# EAGLE design arduipi_test_board (EAGLE 6.4)
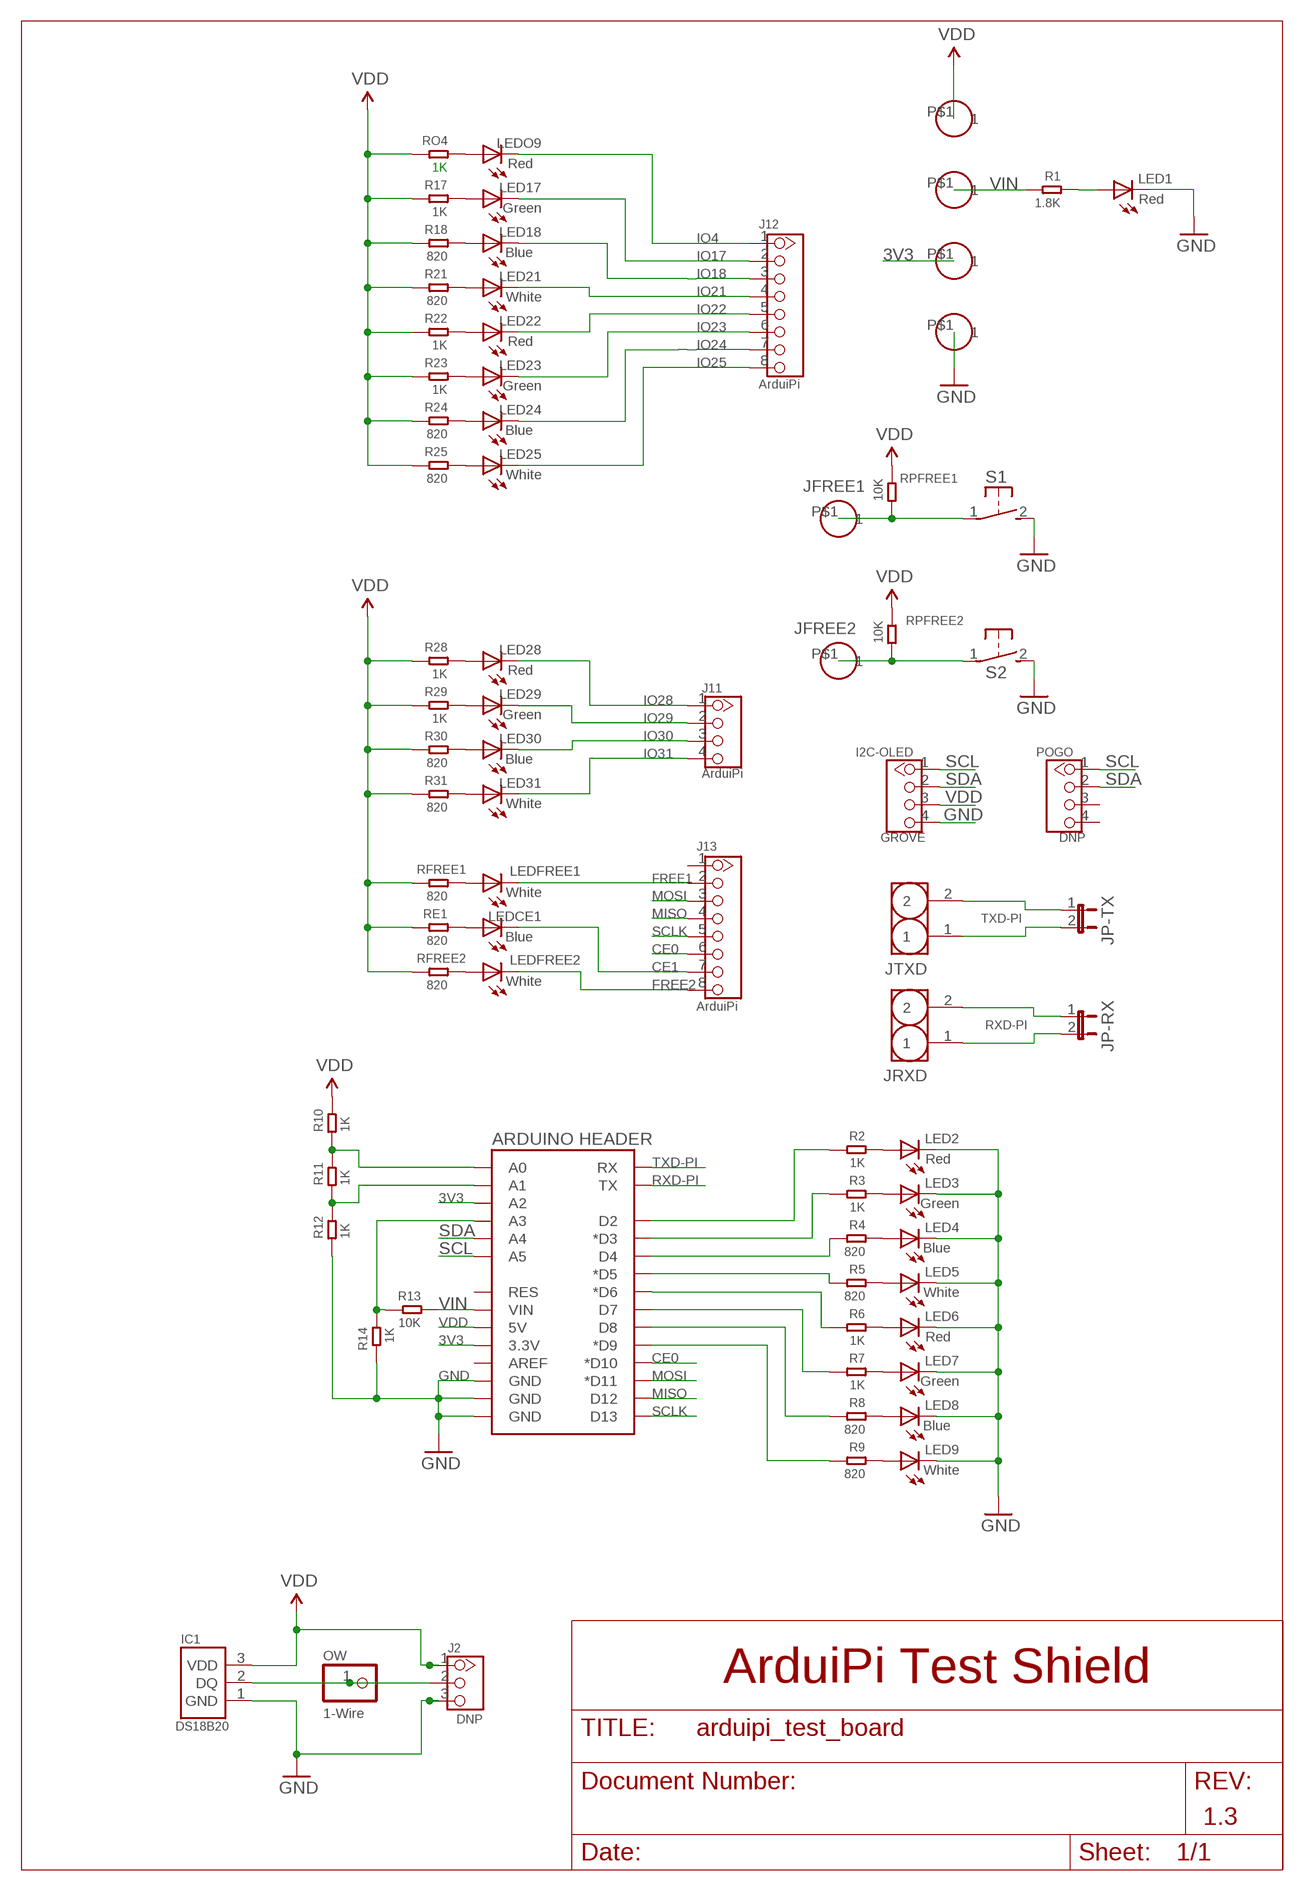
[diagram p0: schematic, sheet 1]

## Parts
3V3  HEADER-1P-32  [1P-60/32MIL]
GND  HEADER-1P-32  [1P-60/32MIL]
I2C-OLED  GROVE  TWIG-2.0-LEADED  [4P-LEADED-2.0]
IC1  DS18B20  SENSOR-DS18B20  [TO-92-TRIANGLE]
J2  DNP  HEADER-3P-2.54  [3P-2.54]
J11  ArduiPi  HEADER-4P-80/40MIL  [4P-2.54-80/40MIL]
J12  ArduiPi  HEADER-8P-80/40MIL  [8P-2.54-80/40MIL]
J13  ArduiPi  HEADER-8P-80/40MIL  [8P-2.54-80/40MIL]
JFREE1  HEADER-1P-32  [1P-60/32MIL]
JFREE2  HEADER-1P-32  [1P-60/32MIL]
JP-RX  JUMPER-2PTH  [1X02]
JP-TX  JUMPER-2PTH  [1X02]
JRXD  J2  HEADER-2P-2.54  [2P-2.54]
JTXD  J1  HEADER-2P-2.54  [2P-2.54]
LED1  Red  LED3MM  [LED3MM]
LED2  Red  LED3MM  [LED3MM]
LED3  Green  LED3MM  [LED3MM]
LED4  Blue  LED3MM  [LED3MM]
LED5  White  LED3MM  [LED3MM]
LED6  Red  LED3MM  [LED3MM]
LED7  Green  LED3MM  [LED3MM]
LED8  Blue  LED3MM  [LED3MM]
LED9  White  LED3MM  [LED3MM]
LED17  Green  LED3MM  [LED3MM]
LED18  Blue  LED3MM  [LED3MM]
LED21  White  LED3MM  [LED3MM]
LED22  Red  LED3MM  [LED3MM]
LED23  Green  LED3MM  [LED3MM]
LED24  Blue  LED3MM  [LED3MM]
LED25  White  LED3MM  [LED3MM]
LED28  Red  LED3MM  [LED3MM]
LED29  Green  LED3MM  [LED3MM]
LED30  Blue  LED3MM  [LED3MM]
LED31  White  LED3MM  [LED3MM]
LEDCE1  Blue  LED3MM  [LED3MM]
LEDFREE1  White  LED3MM  [LED3MM]
LEDFREE2  White  LED3MM  [LED3MM]
LEDO9  Red  LED3MM  [LED3MM]
OW  1-Wire  PINHD-1X1  [1X01]
POGO  DNP  TWIG-2.0-LEADED  [4P-LEADED-2.0]
R1  1.8K  R-0204/7  [0204/7]
R2  1K  R-0204/7  [0204/7]
R3  1K  R-0204/7  [0204/7]
R4  820  R-0204/7  [0204/7]
R5  820  R-0204/7  [0204/7]
R6  1K  R-0204/7  [0204/7]
R7  1K  R-0204/7  [0204/7]
R8  820  R-0204/7  [0204/7]
R9  820  R-0204/7  [0204/7]
R10  1K  R-0204/7  [0204/7]
R11  1K  R-0204/7  [0204/7]
R12  1K  R-0204/7  [0204/7]
R13  10K  R-0204/7  [0204/7]
R14  1K  R-0204/7  [0204/7]
R17  1K  R-0204/7  [0204/7]
R18  820  R-0204/7  [0204/7]
R21  820  R-0204/7  [0204/7]
R22  1K  R-0204/7  [0204/7]
R23  1K  R-0204/7  [0204/7]
R24  820  R-0204/7  [0204/7]
R25  820  R-0204/7  [0204/7]
R28  1K  R-0204/7  [0204/7]
R29  1K  R-0204/7  [0204/7]
R30  820  R-0204/7  [0204/7]
R31  820  R-0204/7  [0204/7]
RE1  820  R-0204/7  [0204/7]
RFREE1  820  R-0204/7  [0204/7]
RFREE2  820  R-0204/7  [0204/7]
RO4  1K  R-0204/7  [0204/7]
RPFREE1  10K  R-0204/7  [0204/7]
RPFREE2  10K  R-0204/7  [0204/7]
S1  DTS-3  [DTS-3]
S2  DTS-3  [DTS-3]
U1  ARDUINO HEADER  ARDUINO_SHIELDNO_SILK  [DUEMILANOVE_VIAS]
VDD  HEADER-1P-32  [1P-60/32MIL]
VIN  HEADER-1P-32  [1P-60/32MIL]

## Nets
3V3: 3V3.P$1 U1.3.3V U1.A2
CE0: J13.6 U1.D10(*D10)
CE1: J13.7 LEDCE1.K(C)
DQ: IC1.2(DQ) J2.2 OW.1
FREE1: J13.2 LEDFREE1.K(C)
FREE1-PI: JFREE1.P$1 RPFREE1.2 S1.1
FREE2: J13.8 LEDFREE2.K(C)
FREE2-PI: JFREE2.P$1 RPFREE2.1 S2.1
GND: GND.P$1 I2C-OLED.4 IC1.1(GND) J2.3 LED1.K(C) LED2.K(C) LED3.K(C) LED4.K(C) LED5.K(C) LED6.K(C) LED7.K(C) LED8.K(C) LED9.K(C) R12.1 R14.2 S1.2 S2.2 U1.GND@0(GND) U1.GND@1(GND) U1.GND@2(GND)
IO4: J12.1 LEDO9.K(C)
IO17: J12.2 LED17.K(C)
IO18: J12.3 LED18.K(C)
IO21: J12.4 LED21.K(C)
IO22: J12.5 LED22.K(C)
IO23: J12.6 LED23.K(C)
IO24: J12.7 LED24.K(C)
IO25: J12.8 LED25.K(C)
IO28: J11.1 LED28.K(C)
IO29: J11.2 LED29.K(C)
IO30: J11.3 LED30.K(C)
IO31: J11.4 LED31.K(C)
MISO: J13.4 U1.D12
MOSI: J13.3 U1.D11(*D11)
N$1: R11.1 R12.2 U1.A1
N$2: R10.1 R11.2 U1.A0
N$3: LED1.A R1.1
N$4: R13.2 R14.1 U1.A3
N$5: LED2.A R2.1
N$6: JP-TX.2 JTXD.1
N$7: LED3.A R3.1
N$8: LED4.A R4.1
N$9: LED5.A R5.1
N$10: JP-RX.2 JRXD.1
N$11: LED6.A R6.1
N$12: LED7.A R7.1
N$13: LED8.A R8.1
N$14: LED9.A R9.1
N$16: LEDO9.A RO4.1
N$17: LED17.A R17.1
N$18: LED18.A R18.1
N$19: LED21.A R21.1
N$20: LED22.A R22.1
N$21: LED23.A R23.1
N$22: LED24.A R24.1
N$23: R9.2 U1.D9(*D9)
N$24: R8.2 U1.D8
N$25: R7.2 U1.D7
N$26: R6.2 U1.D6(*D6)
N$27: R5.2 U1.D5(*D5)
N$28: R4.2 U1.D4
N$29: R3.2 U1.D3(*D3)
N$30: R2.2 U1.D2
N$31: LED25.A R25.1
N$33: LEDFREE1.A RFREE1.1
N$51: LED28.A R28.1
N$52: LED29.A R29.1
N$53: LED30.A R30.1
N$54: LED31.A R31.1
N$57: LEDCE1.A RE1.1
N$58: LEDFREE2.A RFREE2.1
RXD-PI: JP-RX.1 JRXD.2 U1.TX
SCL: I2C-OLED.1 POGO.1 U1.A5
SCLK: J13.5 U1.D13
SDA: I2C-OLED.2 POGO.2 U1.A4
TXD-PI: JP-TX.1 JTXD.2 U1.RX
VDD: I2C-OLED.3 IC1.3(VDD) J2.1 R10.2 R17.2 R18.2 R21.2 R22.2 R23.2 R24.2 R25.2 R28.2 R29.2 R30.2 R31.2 RE1.2 RFREE1.2 RFREE2.2 RO4.2 RPFREE1.1 RPFREE2.2 U1.5V VDD.P$1
VIN: R1.2 R13.1 U1.VIN VIN.P$1
Unconnected: J13.1 POGO.3 POGO.4 U1.AREF U1.RES

## Notes on the sheet
- ArduiPi Test Shield
- 1.3

## Library data of the parts
3V3 GND JFREE1 JFREE2 VDD VIN = Seeedstudio-Connector:HEADER-1P
I2C-OLED POGO = Connector:TWIG-2.0-LEADED
IC1 = Seeedstudio-Discrete.rpt:SENSOR-DS18B20: DS18B20: Programmable Resolution 1-Wire Digital Thermometer http://datasheets.maxim-ic.com/en/ds/DS18B20.pdf
J2 = Seeedstudio-Connector:HEADER-3P
J11 = Seeedstudio-Connector:HEADER-4P
J12 J13 = Seeedstudio-Connector:HEADER-8P
JP-RX JP-TX = SparkFun-Passives:JUMPER-2: Jumper Basic 0.1" spaced jumper. Use with breakaway headers.
JRXD JTXD = Seeedstudio-Connector:HEADER-2P
LED1-LED9 LED17 LED18 LED21-LED25 LED28-LED31 LEDCE1 LEDFREE1 LEDFREE2 LEDO9 = led:LED: LED OSRAM: - CHIPLED LG R971, LG N971, LY N971, LG Q971, LY Q971, LO R971, LY R971 LH N974, LH R974 LS Q976, LO Q976, LY Q976 LO Q996 - Hyper CHIPLED LW Q18S LB Q993, LB Q99A, LB R99A - SideLED LS A670, LO A670, LY A670, LG A670, LP A670 LB A673, LV A673, LT A673, LW A673 LH A674 LY A675 LS A676, LA A676, LO A676, LY A676, LW A676 LS A679, LY A679, LG A679 - Hyper Micro SIDELED® LS Y876, LA Y876, LO Y876, LY Y876 LT Y87S - SmartLED LW L88C, LW L88S LB L89C, LB L89S, LG L890 LS L89K, LO L89K, LY L89K LS L896, LA L896, LO L896, LY L896 - TOPLED LS T670, LO T670, LY T670, LG T670, LP T670 LSG T670, LSP T670, LSY T670, LOP T670, LYG T670 LG T671, LOG T671, LSG T671 LB T673, LV T673, LT T673, LW T673 LH T674 LS T676, LA T676, LO T676, LY T676, LB T676, LH T676, LSB T676, LW T676 LB T67C, LV T67C, LT T67C, LS T67K, LO T67K, LY T67K, LW E67C LS E67B, LA E67B, LO E67B, LY E67B, LB E67C, LV E67C, LT E67C LW T67C LS T679, LY T679, LG T679 LS T770, LO T770, LY T770, LG T770, LP T770 LB T773, LV T773, LT T773, LW T773 LH T774 LS E675, LA E675, LY E675, LS T675 LS T776, LA T776, LO T776, LY T776, LB T776 LHGB T686 LT T68C, LB T68C - Hyper Mini TOPLED® LB M676 - Mini TOPLED Santana® LG M470 LS M47K, LO M47K, LY M47K Source: http://www.osram.convergy.de LUXEON: - LUMILED® LXK2-PW12-R00, LXK2-PW12-S00, LXK2-PW14-U00, LXK2-PW14-V00 LXK2-PM12-R00, LXK2-PM12-S00, LXK2-PM14-U00 LXK2-PE12-Q00, LXK2-PE12-R00, LXK2-PE12-S00, LXK2-PE14-T00, LXK2-PE14-U00 LXK2-PB12-K00, LXK2-PB12-L00, LXK2-PB12-M00, LXK2-PB14-N00, LXK2-PB14-P00, LXK2-PB14-Q00 LXK2-PR12-L00, LXK2-PR12-M00, LXK2-PR14-Q00, LXK2-PR14-R00 LXK2-PD12-Q00, LXK2-PD12-R00, LXK2-PD12-S00 LXK2-PH12-R00, LXK2-PH12-S00 LXK2-PL12-P00, LXK2-PL12-Q00, LXK2-PL12-R00 Source: www.luxeon.com KINGBRIGHT: KA-3528ASYC Source: www.kingbright.com
OW = adafruit:PINHD-1X1: Pin header 1x1 for 0.1" spacing With round pins
R1-R14 R17 R18 R21-R25 R28-R31 RE1 RFREE1 RFREE2 RO4 RPFREE1 RPFREE2 = Seeedstudio-Discrete.rpt:R*
S1 S2 = switch-tact:DTS-3
U1 = SparkFun-Boards:ARDUINO_SHIELD: Arduino shield footprint

## Net classes
0 default: width 0.203 mm, drill 0.305 mm, clearance 0.152 mm
1 GND: width 0.305 mm, drill 0.305 mm, clearance 0.152 mm
2 VDD: width 0.305 mm, drill 0.305 mm, clearance 0.152 mm

## Board
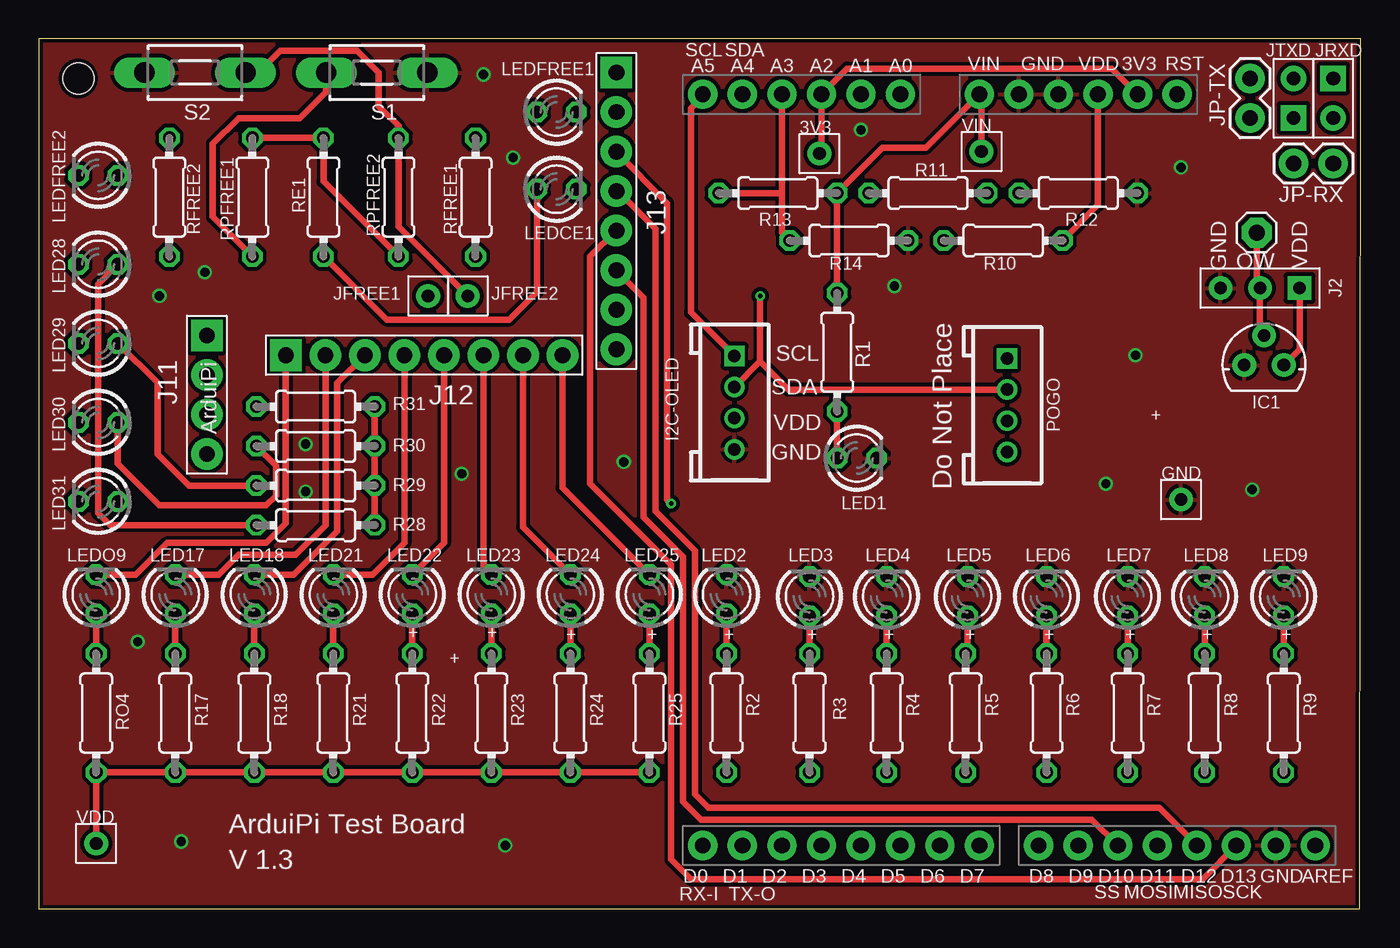
[diagram p1: board, top side]
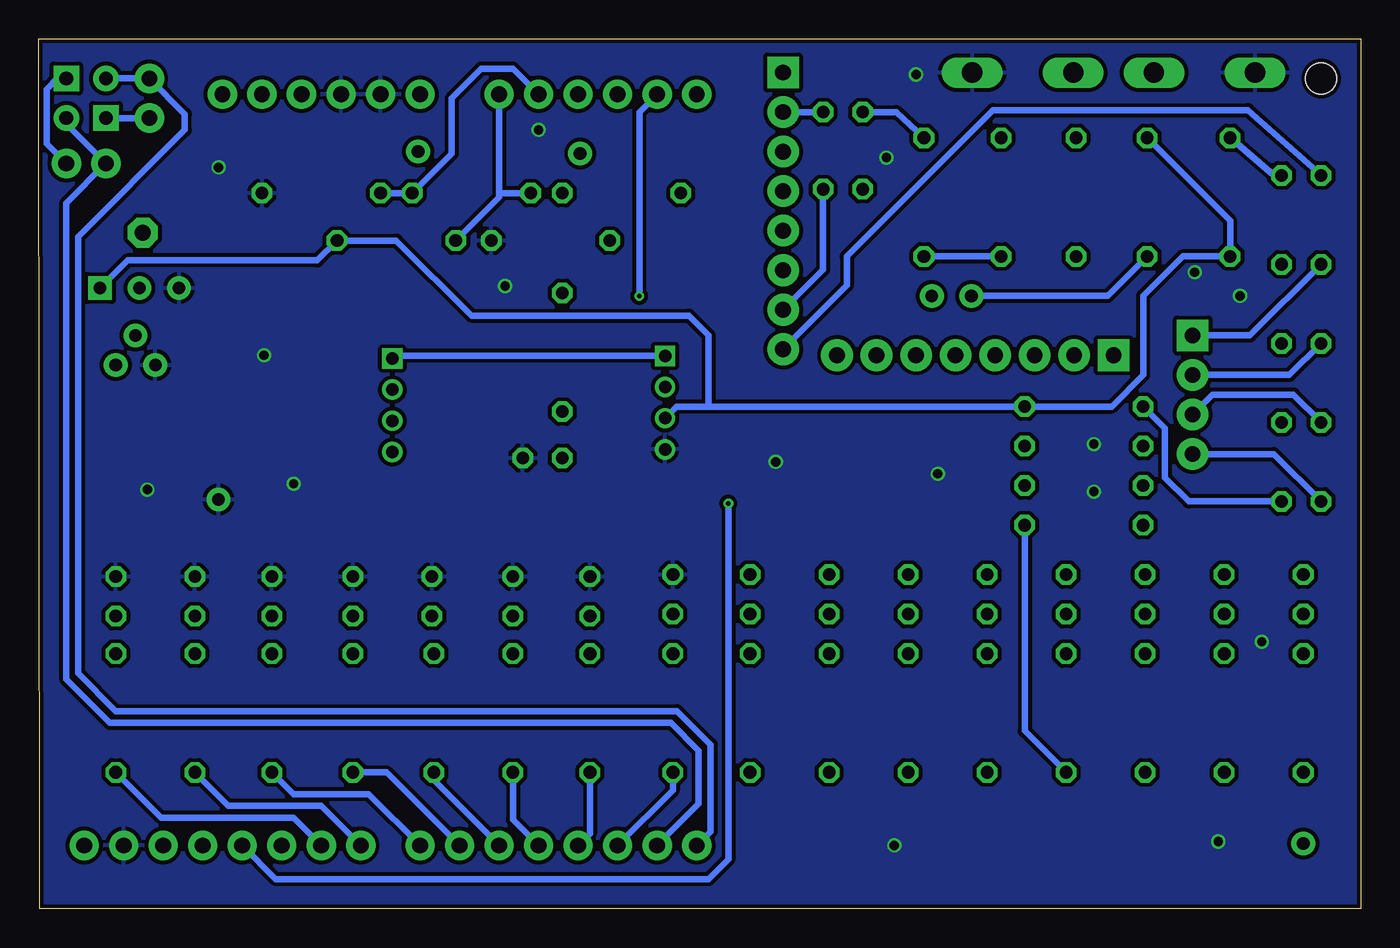
[diagram p2: board, bottom side, seen from below]

Size 84.95 x 55.88 mm. Coordinates in mm from the lower left corner, seen from the top.
Outline: 0,0 84.89,0 84.95,55.88 0,55.88 0,0
Copper layers (1*16): Top 0.035mm / dielectric 1.5mm / Bottom 0.035mm
Design rules "SeedStudio_v1.1": minimum track width 6mil, minimum drill 12mil, track to track 6mil, track to pad 6mil, pad to pad 6mil, via to via 6mil, smd to smd 0mil, copper to edge 10mil, drill to drill 10mil, minimum pad ring 10mil, minimum via ring 6mil, stop-mask expansion 2mil, vias tented up to drill 100mil, thermal gap 10mil
Holes 2 mm at 2.54,53.34

### Footprints (pad centres in the part's own frame; a part is rotated, then mirrored left to right if it is on the bottom)
1P-60/32MIL = drill 0.813 pad 1.524: P$1 0,0
4P-LEADED-2.0 = drill 0.8 pad 1.27 square: 1 -3,0 | drill 0.8 pad 1.27: 2 -1,0; 3 1,0; 4 3,0
TO-92-TRIANGLE = drill 0.813 pad 1.524: 1 -1.27,0; 2 0,1.905; 3 1.27,0
3P-2.54 = drill 0.813 pad 1.524 square: 1 0,2.54 | drill 0.813 pad 1.524: 2 0,0; 3 0,-2.54
4P-2.54-80/40MIL = drill 1.016 pad 2.032 square: 1 0,3.81 | drill 1.016 pad 2.032: 2 0,1.27; 3 0,-1.27; 4 0,-3.81
8P-2.54-80/40MIL = drill 1.016 pad 2.032 square: 1 0,8.89 | drill 1.016 pad 2.032: 2 0,6.35; 3 0,3.81; 4 0,1.27; 5 0,-1.27; 6 0,-3.81; 7 0,-6.35; 8 0,-8.89
1X02 = drill 1.016 pad 1.88: 1 0,0; 2 2.54,0
2P-2.54 = drill 0.889 pad 1.651 square: 1 0,1.27 | drill 0.889 pad 1.651: 2 0,-1.27
LED3MM = drill 0.813 octagon: A -1.27,0; K 1.27,0
1X01 = drill 1.016 pad 1.93 octagon: 1 0,0
0204/7 = drill 0.813 octagon: 1 -3.81,0; 2 3.81,0
DTS-3 = drill 1.3 long: 1 -3.25,0; 2 3.25,0
DUEMILANOVE_VIAS = drill 1.016 pad 1.88: 3.3V 50.8,13.97; 5V 50.8,16.51; A0 50.8,29.21; A1 50.8,31.75; A2 50.8,34.29; A3 50.8,36.83; A4 50.8,39.37; A5 50.8,41.91; AREF 2.54,2.54; D2 2.54,36.83; D3 2.54,34.29; D4 2.54,31.75; D5 2.54,29.21; D6 2.54,26.67; D7 2.54,24.13; D8 2.54,20.32; D9 2.54,17.78; D10 2.54,15.24; D11 2.54,12.7; D12 2.54,10.16; D13 2.54,7.62; GND@0 50.8,19.05; GND@1 50.8,21.59; GND@2 2.54,5.08; RES 50.8,11.43; RX 2.54,41.91; TX 2.54,39.37; VIN 50.8,24.13

### Placement (x,y rotation side)
3V3  50.16,48.51 0 top
GND  73.41,26.29 0 top
I2C-OLED  44.7,32.51 270 top
IC1  78.74,34.92 0 top
J2  78.49,39.88 270 top
J11  10.79,33.02 0 top
J12  24.77,35.56 90 top
J13  37.12,44.83 0 top
JFREE1  25.02,39.37 0 top
JFREE2  27.56,39.37 0 top
JP-RX  80.64,47.88 0 top
JP-TX  77.85,53.34 270 top
JRXD  83.19,52.07 0 top
JTXD  80.64,52.07 180 top
LED1  52.58,28.96 0 top
LED2  44.2,20.19 90 top
LED3  49.53,20.07 90 top
LED4  54.48,20.07 90 top
LED5  59.69,20.07 90 top
LED6  64.77,20.07 90 top
LED7  69.98,20.07 90 top
LED8  74.93,20.07 90 top
LED9  80.01,20.07 90 top
LED17  8.76,20.19 90 top
LED18  13.84,20.19 90 top
LED21  18.92,20.19 90 top
LED22  24,20.19 90 top
LED23  29.08,20.19 90 top
LED24  34.16,20.19 90 top
LED25  39.24,20.19 90 top
LED28  3.81,41.4 180 top
LED29  3.81,36.32 180 top
LED30  3.81,31.24 180 top
LED31  3.81,26.16 180 top
LEDCE1  33.27,46.23 0 top
LEDFREE1  33.27,51.18 0 top
LEDFREE2  3.81,47.12 180 top
LEDO9  3.68,20.19 90 top
OW  78.27,43.43 0 top
POGO  62.23,32.35 270 top
R1  51.31,35.75 90 top
R2  44.2,12.57 270 top
R3  49.53,12.57 270 top
R4  54.48,12.57 270 top
R5  59.56,12.57 270 top
R6  64.77,12.57 270 top
R7  69.98,12.57 270 top
R8  74.93,12.57 270 top
R9  80.01,12.57 270 top
R10  61.98,42.93 0 top
R11  57.15,45.97 180 top
R12  66.8,45.97 180 top
R13  47.5,45.97 180 top
R14  52.07,42.93 0 top
R17  8.76,12.57 270 top
R18  13.84,12.57 270 top
R21  18.92,12.57 270 top
R22  24,12.57 270 top
R23  29.08,12.57 270 top
R24  34.16,12.57 270 top
R25  39.24,12.57 270 top
R28  17.78,24.64 0 top
R29  17.78,27.18 0 top
R30  17.78,29.72 0 top
R31  17.78,32.26 0 top
RE1  18.29,45.72 90 top
RFREE1  28.07,45.72 270 top
RFREE2  8.38,45.72 270 top
RO4  3.68,12.57 270 top
RPFREE1  13.72,45.72 270 top
RPFREE2  23.11,45.72 270 top
S1  21.72,53.72 0 top
S2  10.03,53.72 180 top
U1  84.58,1.52 90 top
VDD  3.68,4.19 0 top
VIN  60.58,48.64 0 top

### Tracks (layer width: path | path; a pad name or v marks a point on that pad's centre or on a via)
3V3
  Top 0.406: U1.3.3V 68.96,53.98 51.94,53.98 U1.A2 50.29,48.64 3V3.P$1
CE0
  Top 0.406: J13.6 37.12,40.98 38.86,39.24 38.86,25.15 41.4,22.61 41.4,6.86 42.55,5.71 67.69,5.71 U1.D10
CE1
  Bottom 0.406: LEDCE1.K 34.54,41.06 J13.7
DQ
  Top 0.406: OW.1 78.27,40.09 J2.2 78.49,37.08 IC1.2
FREE1
  Bottom 0.406: J13.2 LEDFREE1.K
FREE1-PI
  Top 0.406: RPFREE1.2 11.18,44.45 11.18,49.15 12.83,50.8 16.76,50.8 18.47,52.5 S1.1
  Bottom 0.406: JFREE1.P$1 16.26,39.37 RPFREE1.2
FREE2
  Bottom 0.406: J13.8 33.02,40.04 33.02,41.91 23.62,51.31 7.24,51.31 LEDFREE2.K
FREE2-PI
  Top 0.406: JFREE2.P$1 23.11,43.81 RPFREE2.1 23.11,50.29 21.84,51.56 21.84,53.72 20.45,55.12 15.49,55.12 14.1,53.72 S2.1
GND  (via drill 0.6)
  other vias: 7.75,39.37 30.48,48.26 6.35,17.14 70.48,35.56 10.67,40.89 37.59,28.7 68.58,27.3 77.98,26.92 29.97,4.06 9.14,4.32 73.41,47.62 27.18,27.94 54.99,40.01 28.57,53.59 52.83,50.04 17.14,29.84 17.14,26.8
  pour Bottom (isolate 0.254): 0,0 84.96,0 84.96,55.88 0,55.88 0,0.13
  pour Top (isolate 0.254): 0,0 84.96,0 84.96,55.88 0,55.88 0,0.13
IO4
  Top 0.406: LEDO9.K 6.22,21.46 8.26,23.5 14.61,23.5 15.88,24.77 J12.1
IO17
  Top 0.406: LED17.K 11.56,21.46 12.83,22.73 16.51,22.73 18.41,24.64 J12.2
IO18
  Top 0.406: LED18.K 16.38,21.46 19.18,24.26 19.18,33.78 J12.3
IO21
  Top 0.406: J12.4 23.5,23.5 21.46,21.46 LED21.K
IO22
  Top 0.406: J12.5 26.04,23.5 LED22.K
IO23
  Top 0.406: J12.6 28.57,21.97 LED23.K
IO24
  Top 0.406: J12.7 31.11,24.51 LED24.K
IO25
  Top 0.406: J12.8 33.66,27.05 LED25.K
IO28
  Bottom 0.406: J11.1 7.11,36.83 LED28.K
IO29
  Bottom 0.406: J11.2 4.57,34.29 LED29.K
IO30
  Bottom 0.406: LED30.K 4.32,33.02 9.53,33.02 J11.3
IO31
  Bottom 0.406: J11.4 5.59,29.21 LED31.K
MISO
  Top 0.406: J13.4 37.21,46.1 39.62,43.69 39.62,25.53 42.16,22.99 42.16,7.37 43.05,6.48 72.01,6.48 U1.D12
MOSI  (via drill 0.3 pad 0.64)
  Top 0.406: J13.3 37.12,48.6 40.39,45.34 40.39,26.29 v40.64,26.04
  Bottom 0.406: v40.64,26.04 40.64,3.17 41.91,1.91 69.72,1.91 U1.D11
N$1
  Bottom 0.406: U1.A1 54.48,53.98 56.52,53.98 58.42,52.07 58.42,48.51 R11.1 R12.2
N$2
  Bottom 0.406: U1.A0 55.37,45.85 | 55.37,45.85 55.37,45.72 R10.1 | R11.2 55.24,45.97 55.37,45.85
N$3
  Top 0.406: R1.1 LED1.A
N$4
  Top 0.406: U1.A3 47.75,45.97 | 47.75,45.97 47.75,43.43 R14.1 | R13.2 47.75,45.97
N$5
  Top 0.406: R2.1 LED2.A
N$6
  Bottom 0.406: JP-TX.2 JTXD.1
N$7
  Top 0.406: R3.1 LED3.A
N$8
  Top 0.406: R4.1 LED4.A
N$9
  Top 0.406: LED5.A 59.69,16.51 R5.1
N$10
  Bottom 0.406: JRXD.1 83.76,53.34 84.45,52.64 84.45,49.15 JP-RX.2
N$11
  Top 0.406: LED6.A R6.1
N$12
  Top 0.406: LED7.A R7.1
N$13
  Top 0.406: LED8.A R8.1
N$14
  Top 0.406: LED9.A R9.1
N$16
  Top 0.406: LEDO9.A RO4.1
N$17
  Top 0.406: LED17.A R17.1
N$18
  Top 0.406: LED18.A R18.1
N$19
  Top 0.406: LED21.A R21.1
N$20
  Top 0.406: LED22.A R22.1
N$21
  Top 0.406: LED23.A R23.1
N$22
  Top 0.406: LED24.A R24.1
N$23
  Bottom 0.406: U1.D9 68.58,5.84 77.09,5.84 R9.2
N$24
  Bottom 0.406: U1.D8 66.8,6.6 72.77,6.6 R8.2
N$25
  Bottom 0.406: U1.D7 63.75,7.37 68.58,7.37 R7.2
N$26
  Bottom 0.406: R6.2 62.61,8.76 U1.D6
N$27
  Bottom 0.406: R5.2 59.56,8.26 U1.D5
N$28
  Bottom 0.406: R4.2 54.48,5.71 U1.D4
N$29
  Bottom 0.406: R3.2 49.53,4.83 U1.D3
N$30
  Bottom 0.406: R2.2 44.2,7.62 U1.D2
N$31
  Top 0.406: LED25.A R25.1
N$33
  Bottom 0.406: LEDFREE1.A 29.84,51.18 RFREE1.1
N$51
  Top 0.406: R28.1 4.57,24.64 3.81,25.4 3.81,40.13 LED28.A
N$52
  Top 0.406: R29.1 9.65,27.18 7.62,29.21 7.62,33.78 LED29.A
N$53
  Top 0.406: LED30.A 5.08,28.57 7.75,25.91 14.61,25.91 15.24,26.54 15.24,28.45 R30.1
N$54
  Bottom 0.406: R31.1 12.57,30.86 12.57,27.69 11.05,26.16 LED31.A
N$57
  Top 0.406: RE1.1 22.35,37.85 30.23,37.85 32,39.62 LEDCE1.A
N$58
  Bottom 0.406: LEDFREE2.A 5.59,47.12 RFREE2.1
RXD-PI
  Bottom 0.406: U1.TX 42.55,6.73 42.55,10.16 44.32,11.94 80.39,11.94 83.19,14.73 83.19,45.34 JP-RX.1 83.19,50.42 JRXD.2
SCL
  Top 0.406: U1.A5 42.67,52.2 41.91,51.44 41.91,38.31 I2C-OLED.1
  Bottom 0.406: I2C-OLED.1 62.23,35.51 POGO.1
SCLK
  Top 0.406: J13.5 37.08,43.56 35.43,41.91 35.43,27.3 40.64,22.1 40.64,3.17 41.91,1.91 74.8,1.91 U1.D13
SDA  (via drill 0.3)
  Top 0.406: v46.35,39.37 46.35,35.16 | 46.35,35.16 I2C-OLED.2 | POGO.2 48.17,33.35 46.35,35.16
  Bottom 0.406: v46.35,39.37 46.35,51.18 U1.A4
TXD-PI
  Bottom 0.406: U1.RX 41.78,4.95 41.78,10.54 43.94,12.7 80.01,12.7 82.42,15.11 82.42,43.18 75.56,50.04 75.56,51.05 JP-TX.1 JTXD.2
VDD
  Top 0.406: RPFREE1.1 RE1.2 18.29,46.74 RPFREE2.2 | R31.2 R30.2 R29.2 R28.2 | R25.2 R24.2 R23.2 R22.2 R21.2 R18.2 R17.2 RO4.2 VDD.P$1 | J2.1 81.03,35.94 IC1.3 | U1.5V 68.07,45.21 R10.2
  Bottom 0.406: RFREE1.2 RPFREE2.2 | 41.91,32.26 R31.2 16,32.26 13.97,34.29 13.97,39.37 11.43,41.91 RFREE2.2 8.38,44.2 RPFREE1.1 | 41.91,32.26 43.96,32.26 I2C-OLED.3 | J2.1 79.25,41.66 67.06,41.66 R10.2 61.98,42.93 57.15,38.1 43.18,38.1 41.91,36.83 41.91,32.26 | R28.2 21.59,11.43 R21.2
VIN
  Top 0.406: VIN.P$1 60.58,52.2 U1.VIN 57.02,48.9 54.23,48.9 R13.1 R1.2

### Text on the board
tPlace: SCL | SDA | A5 | A4 | A3 | A2 | A1 | A0 | VIN | GND | VDD | 3V3 | RST | D0 | D1 | D2 | D3 | D4 | D5 | D6 | D7 | D8 | D9 | D10 | D11 | D12 | D13 | GND | AREF | RX-I | TX-O | SS | MOSI | MISO | SCK
tNames: GND | VDD | SCL | SDA | VDD | + | GND | Do Not Place | + | + | + | + | + | + | + | + | + | + | + | + | + | ArduiPi Test Board | V 1.3